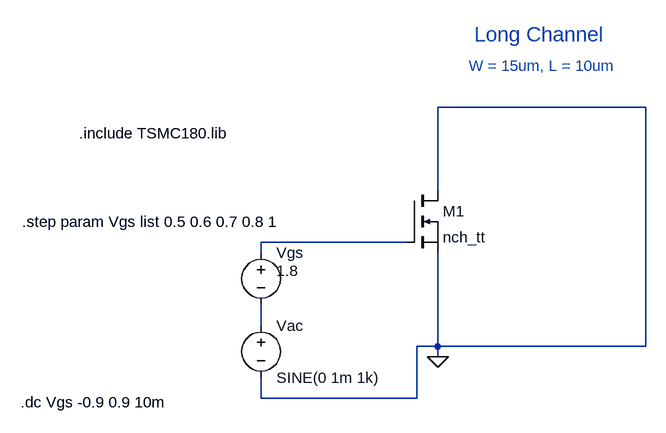
[diagram p0: schematic 2Q2.asc]
2Q2.asc, the LTspice schematic file:
Version 4
SHEET 1 880 680
WIRE 576 32 256 32
WIRE 256 160 256 32
WIRE 208 240 -16 240
WIRE -16 256 -16 240
WIRE -16 368 -16 336
WIRE 256 400 256 256
WIRE 256 400 224 400
WIRE 576 400 576 32
WIRE 576 400 256 400
WIRE 256 416 256 400
WIRE -16 480 -16 448
WIRE 224 480 224 400
WIRE 224 480 -16 480
FLAG 256 416 0
SYMBOL nmos 208 160 R0
SYMATTR InstName M1
SYMATTR Value nch_tt
SYMATTR Value2 l=10u w=15u
SYMBOL voltage -16 240 R0
WINDOW 3 24 44 Left 2
WINDOW 123 0 0 Left 0
WINDOW 39 0 0 Left 0
SYMATTR InstName Vgs
SYMATTR Value 1.8
SYMBOL voltage -16 352 R0
WINDOW 123 0 0 Left 0
WINDOW 39 0 0 Left 0
SYMATTR InstName Vac
SYMATTR Value SINE(0 1m 1k)
TEXT -296 72 Left 2 !.include TSMC180.lib
TEXT 312 -80 Left 3 ;Long Channel
TEXT 304 -32 Left 2 ;W = 15um, L = 10um
TEXT -384 208 Left 2 !.step param Vgs list 0.5 0.6 0.7 0.8 1
TEXT -386 486 Left 2 !.dc Vgs -0.9 0.9 10m

The netlist it stands for:
* 2Q2.asc
M1 0 N001 0 0 nch_tt l=10u w=15u
Vgs N001 N002 1.8
Vac N002 0 SINE(0 1m 1k)
.model NMOS NMOS
.model PMOS PMOS
.lib standard.mos
.include TSMC180.lib
* Long Channel
* W = 15um, L = 10um
.step param Vgs list 0.5 0.6 0.7 0.8 1
.dc Vgs -0.9 0.9 10m
.backanno
.end